# EAGLE schematic PCBschematic (EAGLE 9.6.2)
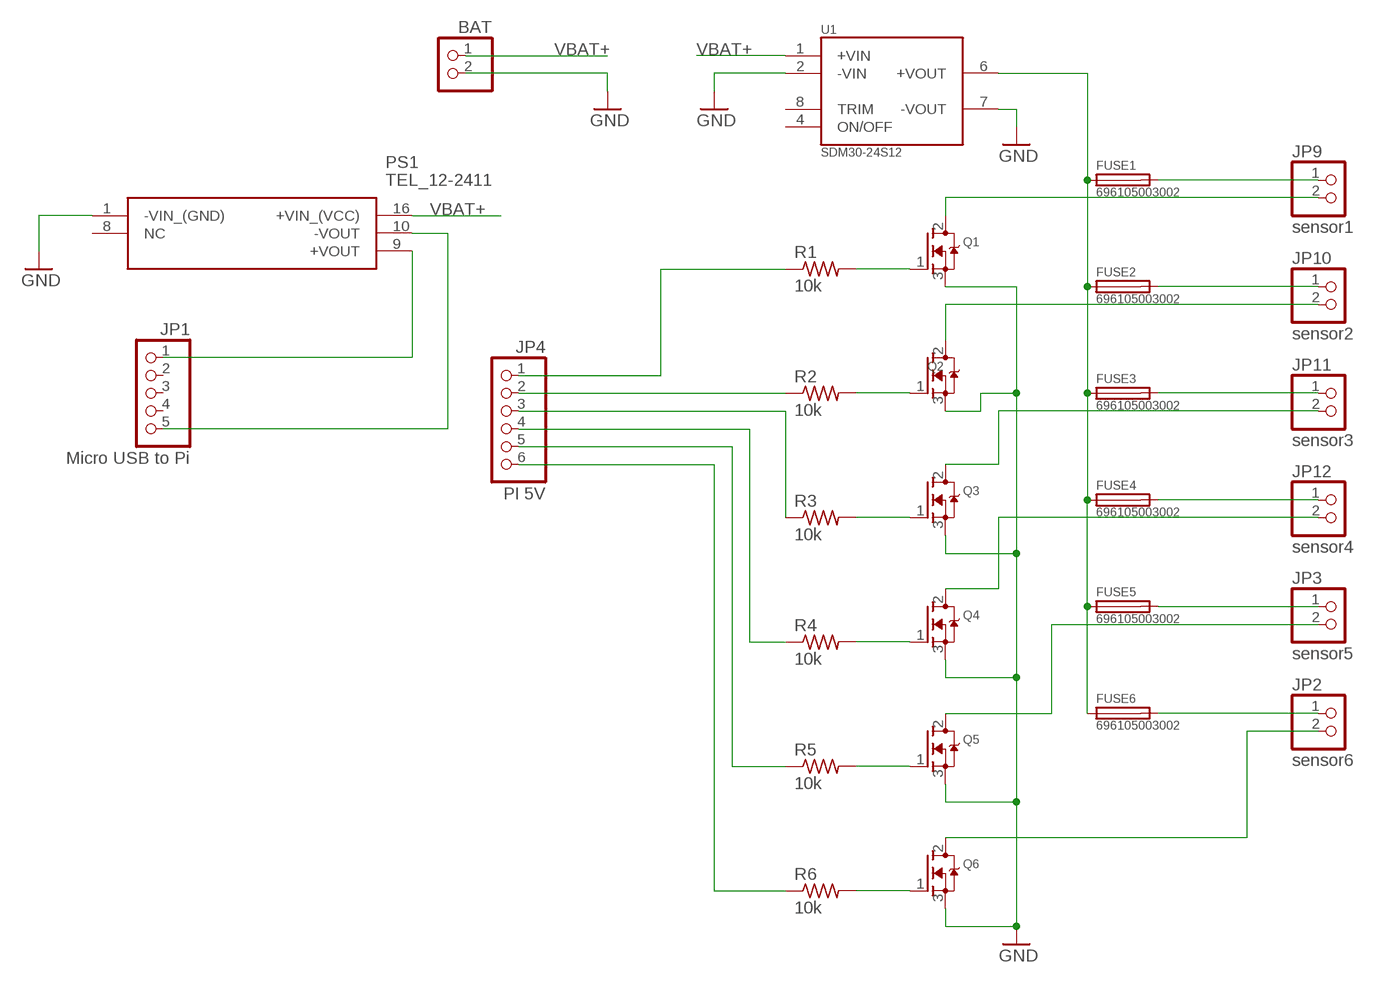
[diagram p0: schematic, sheet 1]

## Parts
BAT  PINHD-1X2  [1X02]
FUSE1  696105003002  [FUSE_696105003002]
FUSE2  696105003002  [FUSE_696105003002]
FUSE3  696105003002  [FUSE_696105003002]
FUSE4  696105003002  [FUSE_696105003002]
FUSE5  696105003002  [FUSE_696105003002]
FUSE6  696105003002  [FUSE_696105003002]
JP1  Micro USB to Pi  PINHD-1X5  [1X05]
JP2  sensor6  PINHD-1X2  [1X02]
JP3  sensor5  PINHD-1X2  [1X02]
JP4  PI 5V  PINHD-1X6  [1X06]
JP9  sensor1  PINHD-1X2  [1X02]
JP10  sensor2  PINHD-1X2  [1X02]
JP11  sensor3  PINHD-1X2  [1X02]
JP12  sensor4  PINHD-1X2  [1X02]
PS1  TEL_12-2411  [TEL122411]
Q1  MOSFET-NGDS_TO220V  [TO220V]
Q2  MOSFET-NGDS_TO220V  [TO220V]
Q3  MOSFET-NGDS_TO220V  [TO220V]
Q4  MOSFET-NGDS_TO220V  [TO220V]
Q5  MOSFET-NGDS_TO220V  [TO220V]
Q6  MOSFET-NGDS_TO220V  [TO220V]
R1  10k  R-US_M0805  [M0805]
R2  10k  R-US_M0805  [M0805]
R3  10k  R-US_M0805  [M0805]
R4  10k  R-US_M0805  [M0805]
R5  10k  R-US_M0805  [M0805]
R6  10k  R-US_M0805  [M0805]
U1  SDM30-24S12  [CONV_SDM30-24S12]

## Nets
GND: BAT.2 PS1.1(-VIN_(GND)) Q1.3(S) Q2.3(S) Q3.3(S) Q4.3(S) Q5.3(S) Q6.3(S) U1.2(-VIN) U1.7(-VOUT)
N$1: JP1.1 PS1.9(+VOUT)
N$2: JP1.5 PS1.10(-VOUT)
N$3: FUSE1.2 JP9.1
N$4: FUSE2.2 JP10.1
N$5: FUSE3.2 JP11.1
N$6: FUSE4.2 JP12.1
N$7: FUSE1.1 FUSE2.1 FUSE3.1 FUSE4.1 FUSE5.1 FUSE6.1 U1.6(+VOUT)
N$8: JP9.2 Q1.2(D)
N$9: JP10.2 Q2.2(D)
N$10: JP11.2 Q3.2(D)
N$11: JP12.2 Q4.2(D)
N$12: Q1.1(G) R1.2
N$13: Q2.1(G) R2.2
N$14: Q3.1(G) R3.2
N$15: Q4.1(G) R4.2
N$16: JP4.1 R1.1
N$17: JP4.2 R2.1
N$18: JP4.3 R3.1
N$19: JP4.4 R4.1
N$20: FUSE6.2 JP2.1
N$22: JP2.2 Q6.2(D)
N$23: Q5.1(G) R5.2
N$24: Q6.1(G) R6.2
N$25: JP4.5 R5.1
N$26: JP4.6 R6.1
N$27: FUSE5.2 JP3.1
N$28: JP3.2 Q5.2(D)
VBAT+: BAT.1 PS1.16(+VIN_(VCC)) U1.1(+VIN)
Unconnected: JP1.2 JP1.3 JP1.4 PS1.8(NC) U1.4(ON/OFF) U1.8(TRIM)

## Library data of the parts
BAT JP2 JP3 JP9-JP12 = pinhead:PINHD-1X2: PIN HEADER
FUSE1-FUSE6 = 696105003002:696105003002: Fuse Holder, 250 V, 10 A, Cartridge Fuse Holder, Through Hole, 1; DESCRIPTION: Fuse Block 10A 250V 1 Circuit Cartridge Through Hole; MF: Wurth Electronics; MP: 696105003002; PACKAGE: None; PURCHASE-URL: https://pricing.snapeda.com/search/part/696105003002/?ref=eda
JP1 = pinhead:PINHD-1X5: PIN HEADER
JP4 = pinhead:PINHD-1X6: PIN HEADER
PS1 = TEL_12-2411:TEL_12-2411: DC/DC Converter TEL 12 Series, 12 Watt 5.1 VDC 2'400 mA Source: Datasheet <https://www.tracopower.com/sites/default/files/products/datasheets/tel12_datasheet.pdf>; DESCRIPTION: DC/DC Converter TEL 12 Series, 12 Watt 5.1 VDC 2'400 mA; HEIGHT: 10.45mm; MANUFACTURER_NAME: Traco Power; MANUFACTURER_PART_NUMBER: TEL 12-2411; MOUSER_PART_NUMBER: 495-TEL12-2411; MOUSER_PRICE-STOCK: https://www.mouser.co.uk/ProductDetail/TRACO-Power/TEL-12-2411?qs=hd1VzrDQEGgh157ULhti9w%3D%3D
Q1-Q6 = adafruit:MOSFET-N: N-Channel Mosfet 2N7002E - 60V 260mA SOT23 [Digikey: 2N7002ET1GOSTR-ND] - REEL BSH103 - 30V 850mA SOT23 [Digikey: 568-5013-1-ND]
R1-R6 = adafruit:R-US_: RESISTOR, American symbol
U1 = SDM30-24S12:SDM30-24S12: DC-DC Converter PCB mount; Input 18-36Vdc; Output 12Vdc at 2.1A; DIL through hole; DESCRIPTION: Isolated Module DC DC Converter 1 Output 12V 2.5A 18V - 36V Input; DIGI-KEY_PART_NUMBER: 1866-4449-ND; MF: MEAN WELL; MP: SDM30-24S12; PACKAGE: DIP-8 Mean Well; PURCHASE-URL: https://pricing.snapeda.com/search/part/SDM30-24S12/?ref=eda